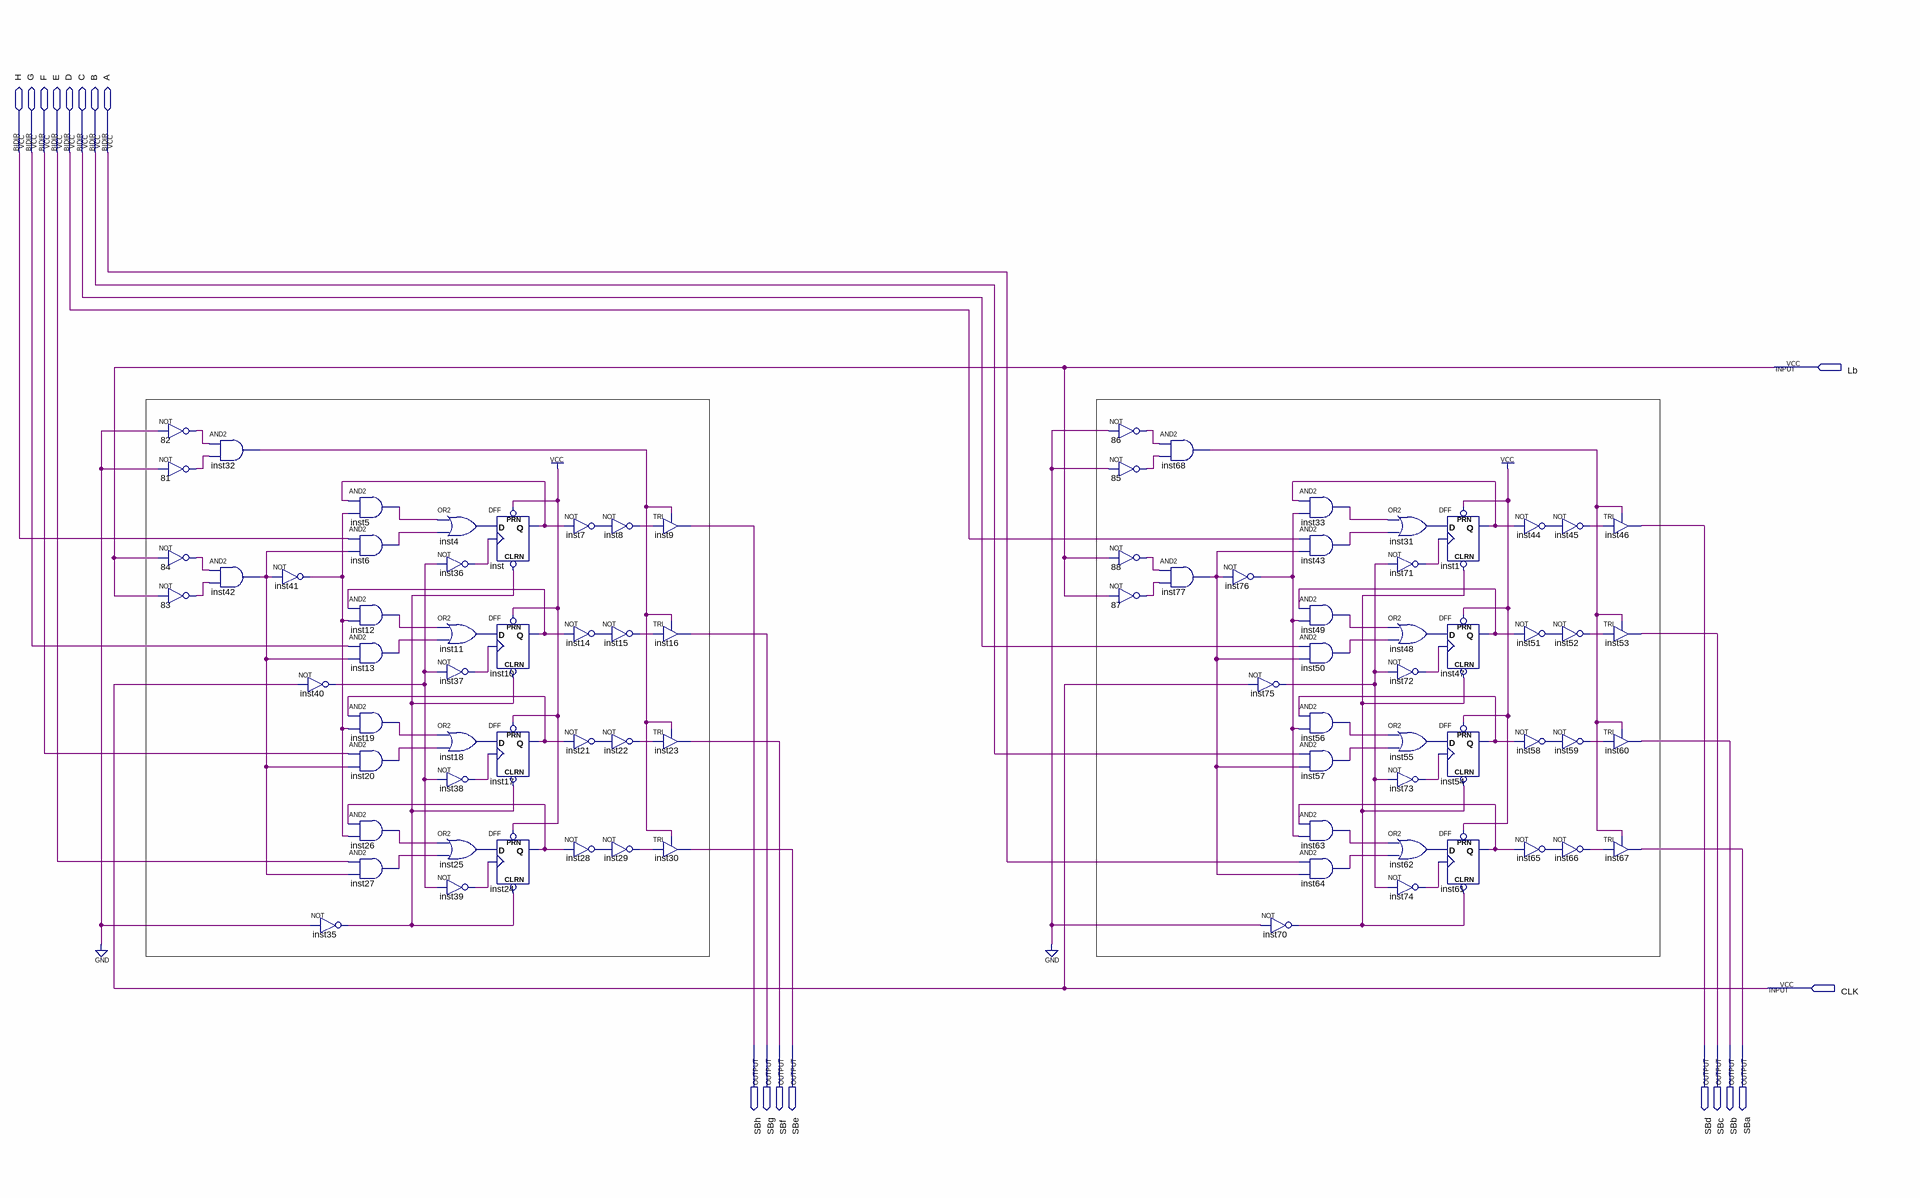
[diagram p0: schematic sheet]
// Quartus schematic b_register.bdf as structural Verilog: 82 symbols, 18 pins
module b_register (
  input  Lb,
  input  CLK,
  inout  H,
  inout  G,
  inout  F,
  inout  E,
  inout  D,
  inout  C,
  inout  B,
  inout  A,
  output SBh,
  output SBg,
  output SBf,
  output SBe,
  output SBd,
  output SBc,
  output SBb,
  output SBa
);

  wire inst1_q, inst4_out, inst5_out, inst6_out, inst7_out, inst8_out, inst10_q, inst11_out, inst12_out,
       inst13_out, inst14_out, inst15_out, inst17_q, inst18_out, inst19_out, inst20_out, inst21_out,
       inst22_out, inst24_q, inst25_out, inst26_out, inst27_out, inst28_out, inst29_out, inst31_out,
       inst32_out, inst33_out, inst35_out, inst36_out, inst37_out, inst38_out, inst39_out, inst40_out,
       inst41_out, inst42_out, inst43_out, inst44_out, inst45_out, inst47_q, inst48_out, inst49_out,
       inst50_out, inst51_out, inst52_out, inst54_q, inst55_out, inst56_out, inst57_out, inst58_out,
       inst59_out, inst61_q, inst62_out, inst63_out, inst64_out, inst65_out, inst66_out, inst68_out,
       inst70_out, inst71_out, inst72_out, inst73_out, inst74_out, inst75_out, inst76_out, inst77_out,
       inst_q, n81_out, n82_out, n83_out, n84_out, n85_out, n86_out, n87_out, n88_out;

  not u_82 (n82_out, 1'b0);
  not u_81 (n81_out, 1'b0);
  not u_84 (n84_out, Lb);
  not u_83 (n83_out, Lb);
  and inst32 (inst32_out, n82_out, n81_out);
  and inst42 (inst42_out, n84_out, n83_out);
  not inst41 (inst41_out, inst42_out);
  not inst40 (inst40_out, CLK);
  not inst35 (inst35_out, 1'b0);
  and inst5 (inst5_out, inst_q, inst41_out);
  and inst6 (inst6_out, H, inst42_out);
  and inst12 (inst12_out, inst10_q, inst41_out);
  and inst13 (inst13_out, G, inst42_out);
  and inst19 (inst19_out, inst17_q, inst41_out);
  and inst20 (inst20_out, F, inst42_out);
  and inst26 (inst26_out, inst24_q, inst41_out);
  and inst27 (inst27_out, E, inst42_out);
  or inst4 (inst4_out, inst5_out, inst6_out);
  not inst36 (inst36_out, inst40_out);
  or inst11 (inst11_out, inst12_out, inst13_out);
  not inst37 (inst37_out, inst40_out);
  or inst18 (inst18_out, inst19_out, inst20_out);
  not inst38 (inst38_out, inst40_out);
  or inst25 (inst25_out, inst26_out, inst27_out);
  not inst39 (inst39_out, inst40_out);
  DFF inst (.CLRN(inst35_out), .CLK(inst36_out), .D(inst4_out), .PRN(1'b1), .Q(inst_q));
  DFF inst10 (.CLRN(inst35_out), .CLK(inst37_out), .D(inst11_out), .PRN(1'b1), .Q(inst10_q));
  DFF inst17 (.CLRN(inst35_out), .CLK(inst38_out), .D(inst18_out), .PRN(1'b1), .Q(inst17_q));
  DFF inst24 (.CLRN(inst35_out), .CLK(inst39_out), .D(inst25_out), .PRN(1'b1), .Q(inst24_q));
  not inst7 (inst7_out, inst_q);
  not inst14 (inst14_out, inst10_q);
  not inst21 (inst21_out, inst17_q);
  not inst28 (inst28_out, inst24_q);
  not inst8 (inst8_out, inst7_out);
  not inst15 (inst15_out, inst14_out);
  not inst22 (inst22_out, inst21_out);
  not inst29 (inst29_out, inst28_out);
  TRI inst9 (.IN(inst8_out), .OE(inst32_out), .OUT(SBh));
  TRI inst16 (.IN(inst15_out), .OE(inst32_out), .OUT(SBg));
  TRI inst23 (.IN(inst22_out), .OE(inst32_out), .OUT(SBf));
  TRI inst30 (.IN(inst29_out), .OE(inst32_out), .OUT(SBe));
  not u_86 (n86_out, 1'b0);
  not u_85 (n85_out, 1'b0);
  not u_88 (n88_out, Lb);
  not u_87 (n87_out, Lb);
  and inst68 (inst68_out, n86_out, n85_out);
  and inst77 (inst77_out, n88_out, n87_out);
  not inst76 (inst76_out, inst77_out);
  not inst75 (inst75_out, CLK);
  and inst33 (inst33_out, inst1_q, inst76_out);
  and inst43 (inst43_out, D, inst77_out);
  and inst49 (inst49_out, inst47_q, inst76_out);
  and inst50 (inst50_out, C, inst77_out);
  and inst56 (inst56_out, inst54_q, inst76_out);
  and inst57 (inst57_out, B, inst77_out);
  and inst63 (inst63_out, inst61_q, inst76_out);
  and inst64 (inst64_out, A, inst77_out);
  not inst70 (inst70_out, 1'b0);
  or inst31 (inst31_out, inst33_out, inst43_out);
  not inst71 (inst71_out, inst75_out);
  or inst48 (inst48_out, inst49_out, inst50_out);
  not inst72 (inst72_out, inst75_out);
  or inst55 (inst55_out, inst56_out, inst57_out);
  not inst73 (inst73_out, inst75_out);
  or inst62 (inst62_out, inst63_out, inst64_out);
  not inst74 (inst74_out, inst75_out);
  DFF inst1 (.CLRN(inst70_out), .CLK(inst71_out), .D(inst31_out), .PRN(1'b1), .Q(inst1_q));
  DFF inst47 (.CLRN(inst70_out), .CLK(inst72_out), .D(inst48_out), .PRN(1'b1), .Q(inst47_q));
  DFF inst54 (.CLRN(inst70_out), .CLK(inst73_out), .D(inst55_out), .PRN(1'b1), .Q(inst54_q));
  DFF inst61 (.CLRN(inst70_out), .CLK(inst74_out), .D(inst62_out), .PRN(1'b1), .Q(inst61_q));
  not inst44 (inst44_out, inst1_q);
  not inst45 (inst45_out, inst44_out);
  not inst51 (inst51_out, inst47_q);
  not inst52 (inst52_out, inst51_out);
  not inst58 (inst58_out, inst54_q);
  not inst59 (inst59_out, inst58_out);
  not inst65 (inst65_out, inst61_q);
  not inst66 (inst66_out, inst65_out);
  TRI inst46 (.IN(inst45_out), .OE(inst68_out), .OUT(SBd));
  TRI inst53 (.IN(inst52_out), .OE(inst68_out), .OUT(SBc));
  TRI inst60 (.IN(inst59_out), .OE(inst68_out), .OUT(SBb));
  TRI inst67 (.IN(inst66_out), .OE(inst68_out), .OUT(SBa));
endmodule
